# Altium schematic sheet modFOC_Debug.SchDoc
size A4; Organization: Altium Limited; Address1: L3, 12a Rodborough Rd; Address2: Frenchs Forest; Address3: NSW; Address4: Australia 2086
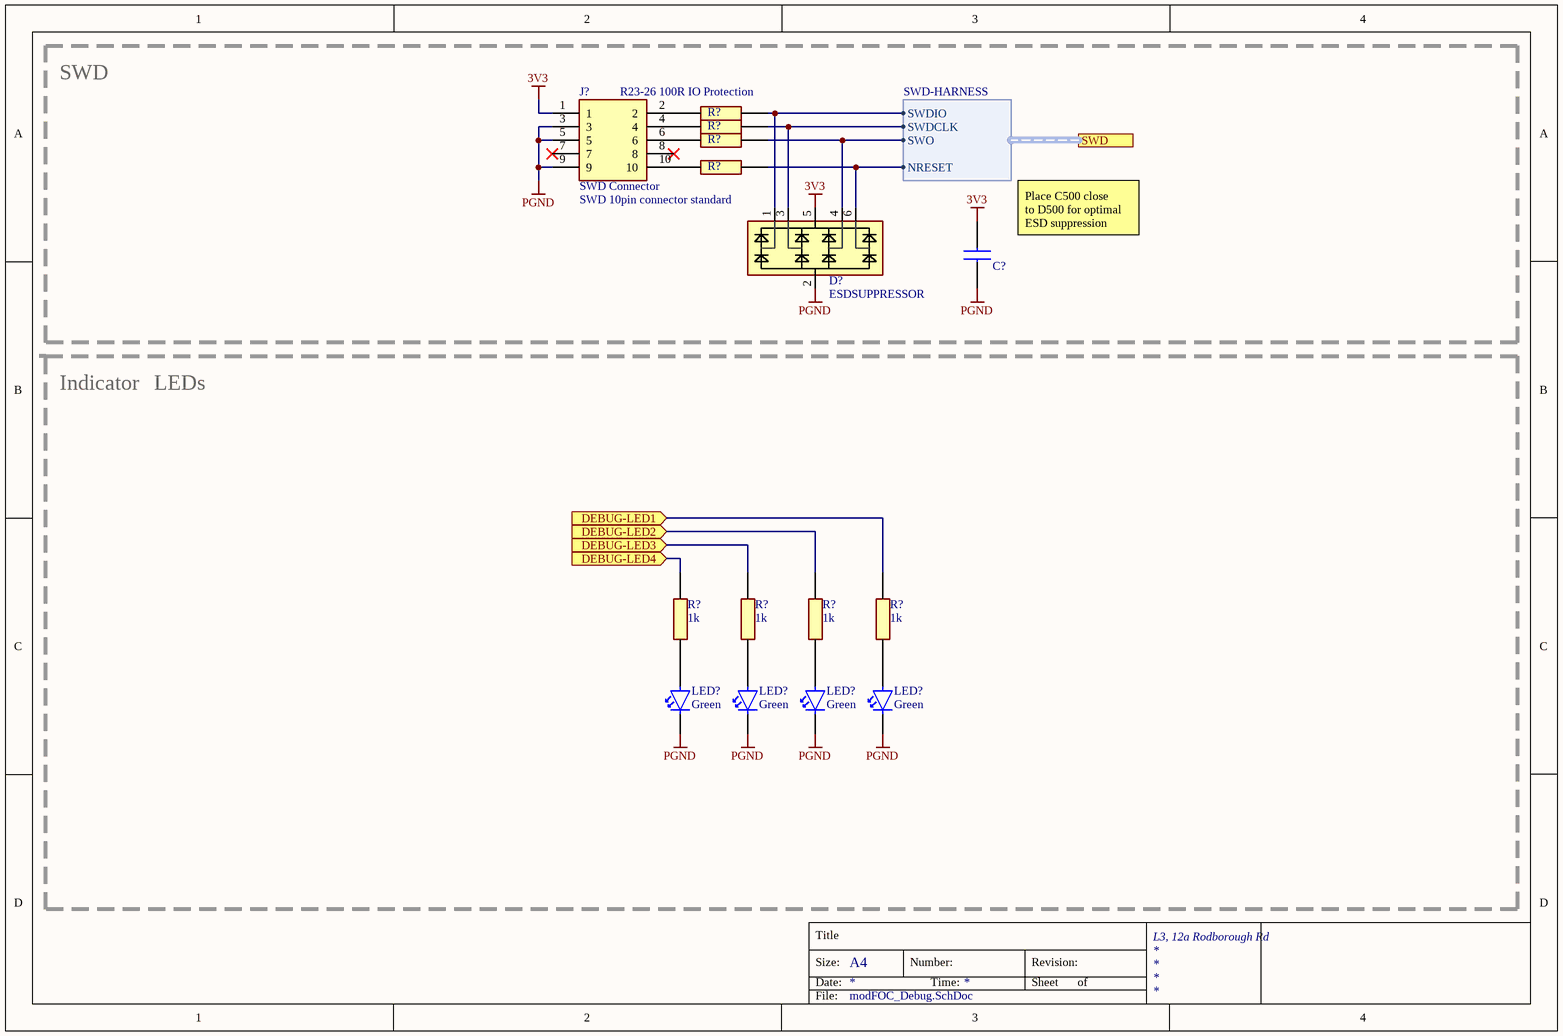
[diagram p0: modFOC_Debug.SchDoc]

## Parts
(Parts that share a designator on the sheet are numbered #1, #2 ... from top to bottom, then left to right.)
C?  100nF  [CAPC1608X97N]  (value not drawn)
D?  ESDSUPPRESSOR  [SOT23-6]
J?  SWD Connector  [HUSSP10W40P127_2X5_635X340X420P]
LED?#1  Green  [CHIPLED_0603]
LED?#2  Green  [CHIPLED_0603]
LED?#3  Green  [CHIPLED_0603]
LED?#4  Green  [CHIPLED_0603]
R?#1  100R  [RESC1005X40N]  (value not drawn)
R?#2  100R  [RESC1005X40N]  (value not drawn)
R?#3  100R  [RESC1005X40N]  (value not drawn)
R?#4  100R  [RESC1005X40N]  (value not drawn)
R?#5  1k  [RESC1608X50N]
R?#6  1k  [RESC1608X50N]
R?#7  1k  [RESC1608X50N]
R?#8  1k  [RESC1608X50N]

## Blocks framed on the sheet
SWD: C? D? J? R?#1-R?#4

## Ports
DEBUG-LED1 (in), DEBUG-LED2 (in), DEBUG-LED3 (in), DEBUG-LED4 (in), SWD (harness SWD-HARNESS)

## Harnesses
SWD-HARNESS: SWDIO, SWDCLK, SWO, NRESET

## Nets
3V3: C?.2 D?.5(VDD) J?.1
PGND: C?.1 D?.2(GND) J?.3 J?.5 J?.9 LED?#1.1(K) LED?#2.1(K) LED?#3.1(K) LED?#4.1(K)
DEBUG-LED1: R?#8.1 ; port DEBUG-LED1
DEBUG-LED2: R?#7.1 ; port DEBUG-LED2
DEBUG-LED3: R?#6.1 ; port DEBUG-LED3
DEBUG-LED4: R?#5.1 ; port DEBUG-LED4
NetD?_1: D?.1(CH1) R?#1.2 ; port SWD.SWDIO
NetD?_3: D?.3(CH2) R?#2.2 ; port SWD.SWDCLK
NetD?_4: D?.4(CH3) R?#3.2 ; port SWD.SWO
NetD?_6: D?.6(CH4) R?#4.2 ; port SWD.NRESET
NetJ?_2: J?.2 R?#1.1
NetJ?_4: J?.4 R?#2.1
NetJ?_6: J?.6 R?#3.1
NetJ?_10: J?.10 R?#4.1
NetLED?#1_2: LED?#1.2(A) R?#5.2
NetLED?#2_2: LED?#2.2(A) R?#6.2
NetLED?#3_2: LED?#3.2(A) R?#7.2
NetLED?#4_2: LED?#4.2(A) R?#8.2

Not connected (* = marked no-connect by the designer): J? 7* 8*

## Notes on the sheet
- R23-26 100R IO Protection
- SWD 10pin connector standard
- (near C?) Place C500 close
  to D500 for optimal
  ESD suppression
- Indicator
- LEDs
- Title
- Size:
- Date:
- A4
- Number:
- Time:
- Revision:
- Sheet
- of
- File:

## Library data of the parts
C? = C0603: Capacitor; Height: 0.97
D? = ESDSUPPRESSOR: TVS Diode Array; Height: 0.6mm
J? = M50-3600542R: Connector; Manufacturer_Name: Harwin; Datasheet Link: https://cdn.harwin.com/pdfs/M50-360R.pdf; Manufacturer_Part_Number: M50-3600542R; Mouser Part Number: 855-M50-3600542R; Mouser Price/Stock: https://www.mouser.co.uk/ProductDetail/Harwin/M50-3600542R?qs=DVxm2sPGGrrPu%2FxuhpV3yw%3D%3D
LED?#1-LED?#4 = CHIPLED0603: LED; Mouser Price/Stock: https://www.mouser.at/c/optoelectronics/led-lighting/led-emitters/standard-leds-smd/?series=CHIPLED%200603&instock=y
R?#1-R?#4 = R0402: Resistor; Height: 0.4mm
R?#5-R?#8 = R0603: Resistor; Manufacturer_Name: Panasonic; Manufacturer_Part_Number: ERJ-PA3J104V; Datasheet Link: https://industrial.panasonic.com/cdbs/www-data/pdf/RDO0000/AOA0000C331.pdf; Height: 0.55mm; Arrow Part Number: ERJ-PA3J104V; Arrow Price/Stock: https://www.arrow.com/en/products/erj-pa3j104v/panasonic; Mouser Part Number: 667-ERJ-PA3J104V; Mouser Price/Stock: https://www.mouser.co.uk/ProductDetail/Panasonic/ERJ-PA3J104V/?qs=BzJM0faLVqV4tD3ZRAThew%3D%3D